# Altium schematic sheet 04. MCU + ANALOG.SchDoc
size A2
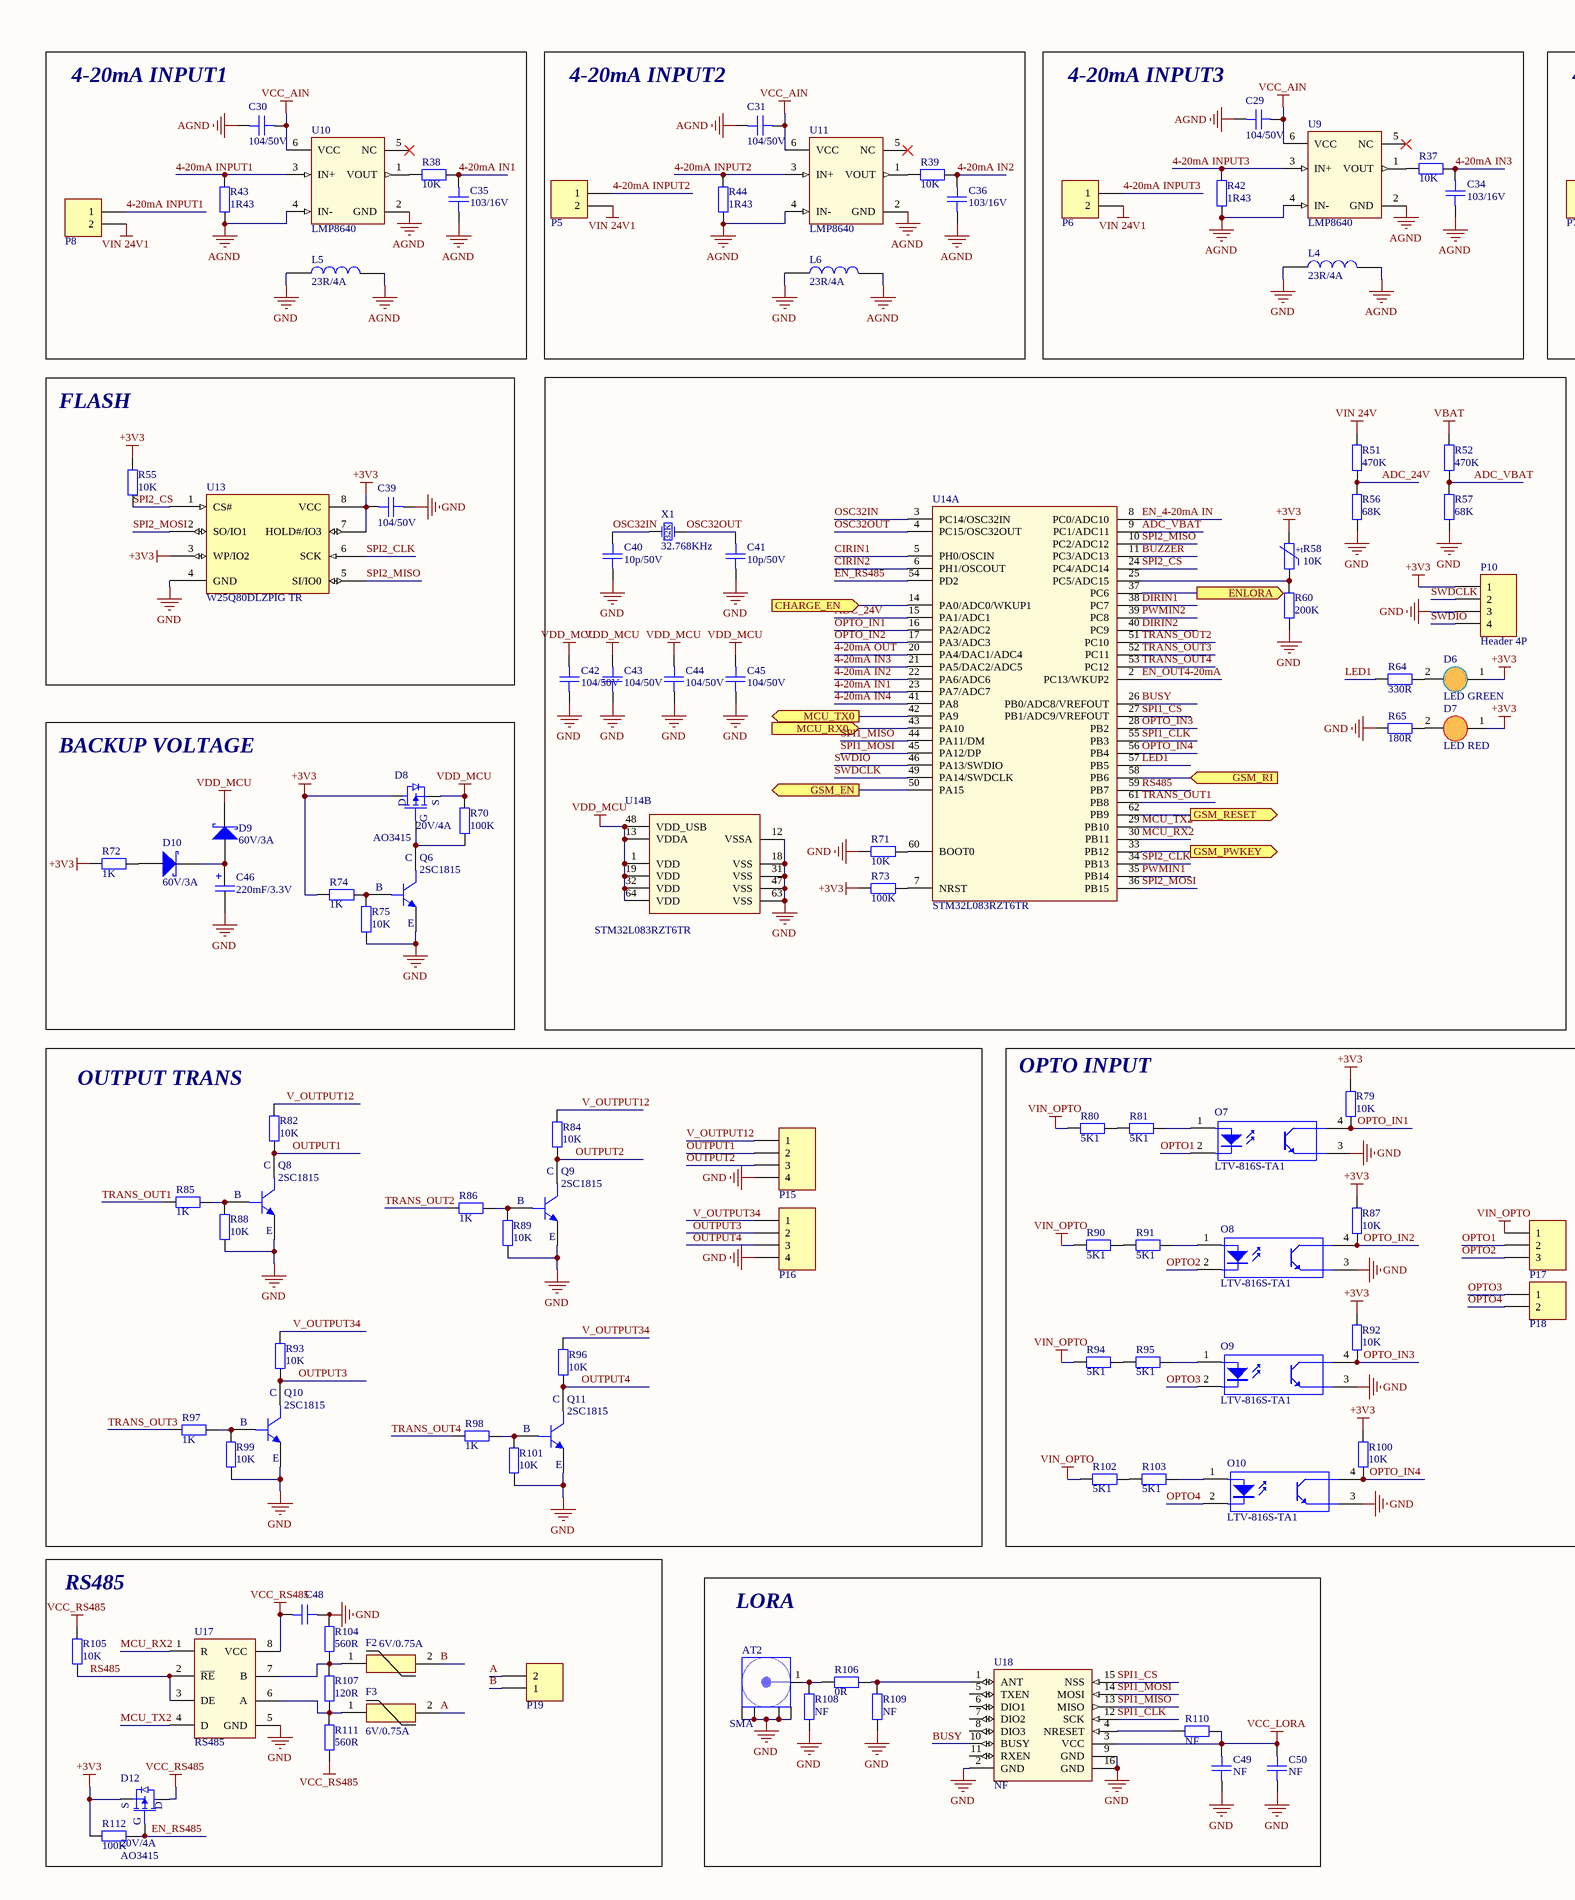
[diagram p0: 04. MCU + ANALOG.SchDoc, left]
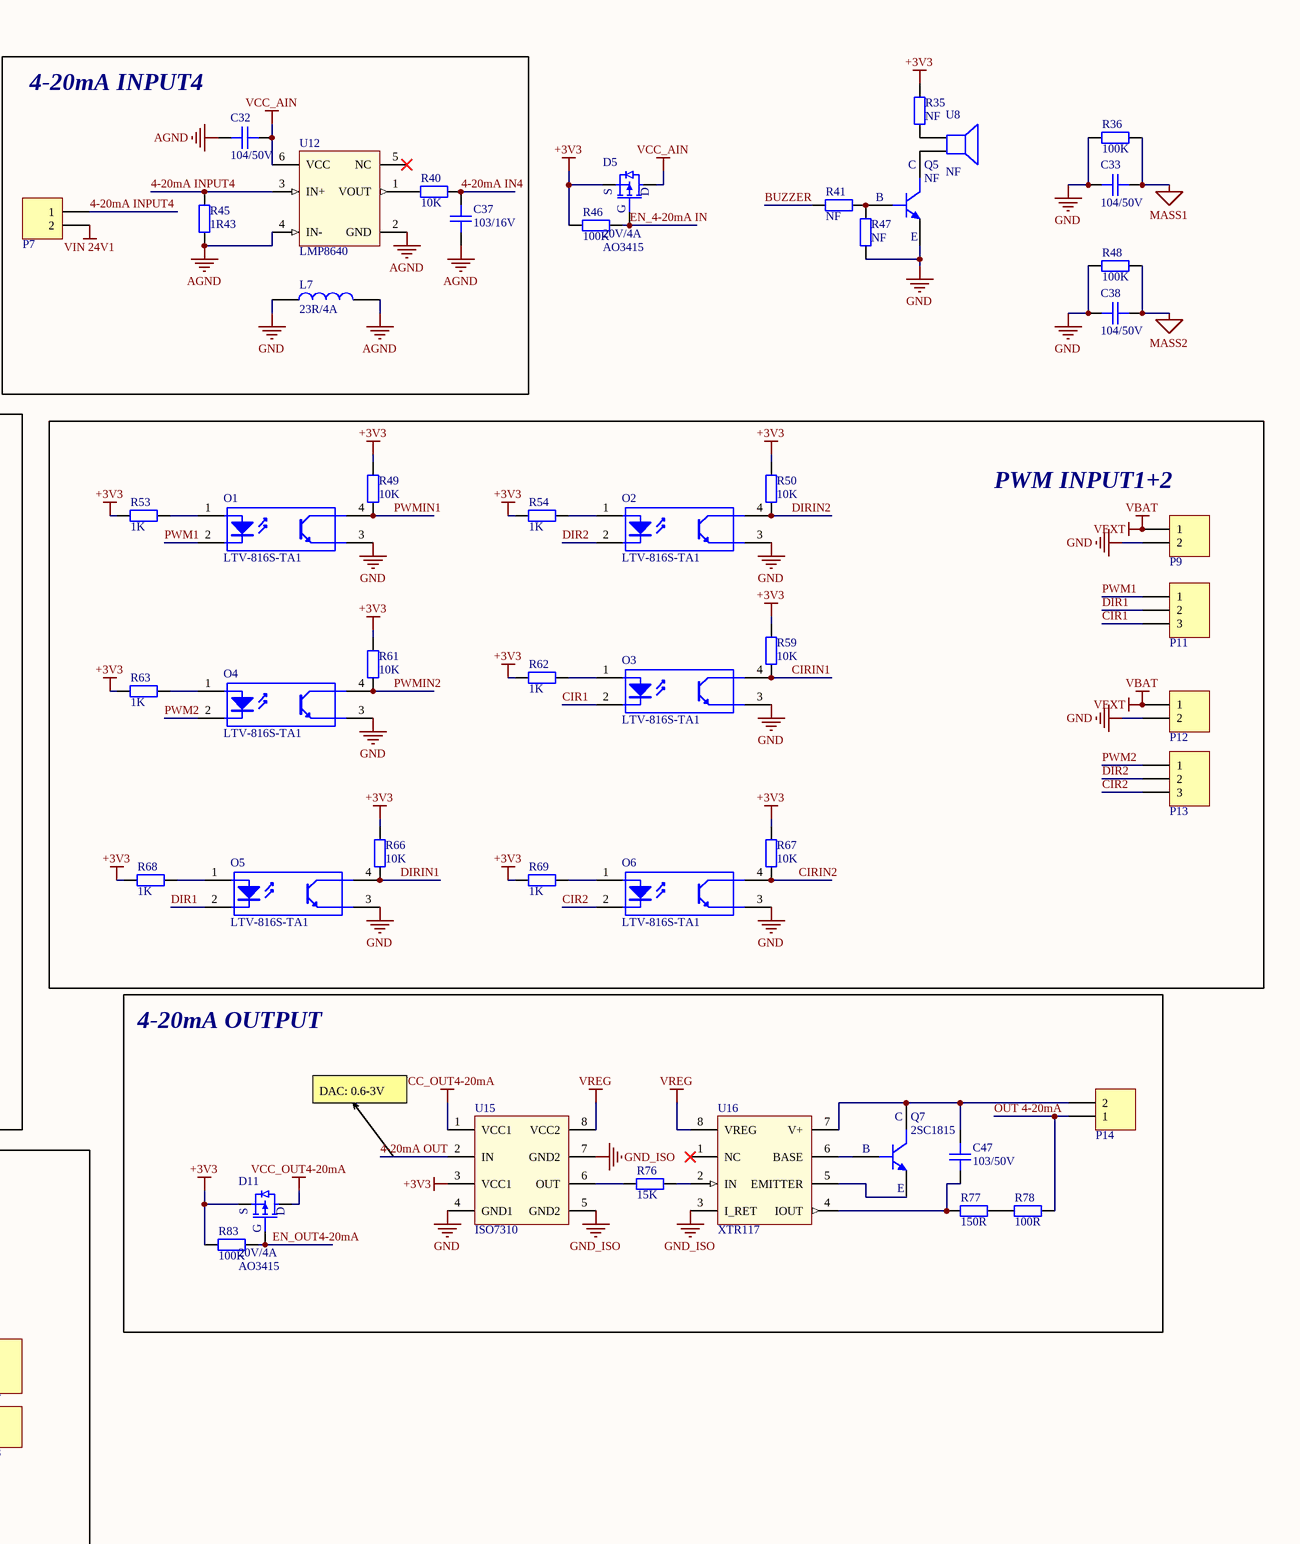
[diagram p1: 04. MCU + ANALOG.SchDoc, right]

## Parts
AT2  SMA  [SMA-KWE-17-V1]
C29  104/50V  [CAPC-0603 (1608)]
C30  104/50V  [CAPC-0603 (1608)]
C31  104/50V  [CAPC-0603 (1608)]
C32  104/50V  [CAPC-0603 (1608)]
C33  104/50V  [CAPC-0603 (1608)]
C34  103/16V  [CAPC-0603 (1608)]
C35  103/16V  [CAPC-0603 (1608)]
C36  103/16V  [CAPC-0603 (1608)]
C37  103/16V  [CAPC-0603 (1608)]
C38  104/50V  [CAPC-0603 (1608)]
C39  104/50V  [CAPC-0603 (1608)]
C40  10p/50V  [CAPC-0603 (1608)]
C41  10p/50V  [CAPC-0603 (1608)]
C42  104/50V  [CAPC-0603 (1608)]
C43  104/50V  [CAPC-0603 (1608)]
C44  104/50V  [CAPC-0603 (1608)]
C45  104/50V  [CAPC-0603 (1608)]
C46  220mF/3.3V  [CAP-SUPER-0.22F]
C47  103/50V  [CAPC-0805 (2012)]
C48  104/50V  [CAPC-0603 (1608)]  (value not drawn)
C49  NF  [CAPC-0603 (1608)]
C50  NF  [CAPC-0603 (1608)]
D5  20V/4A  [SOT23_3]
D6  LED GREEN  [LED_3MM-GREEN]
D7  LED RED  [LED_3MM-RED]
D8  20V/4A  [SOT23_3]
D9  60V/3A  [DIODE_DO214AC_SMA]
D10  60V/3A  [DIODE_DO214AC_SMA]
D11  20V/4A  [SOT23_3]
D12  20V/4A  [SOT23_3]
F2  6V/0.75A  [FUSE 0ZCK_BEL]
F3  6V/0.75A  [FUSE 0ZCK_BEL]
L4  23R/4A  [IND-0603 (1608)]
L5  23R/4A  [IND-0603 (1608)]
L6  23R/4A  [IND-0603 (1608)]
L7  23R/4A  [IND-0603 (1608)]
O1  LTV-816S-TA1  [OPTO 1]
O2  LTV-816S-TA1  [OPTO 1]
O3  LTV-816S-TA1  [OPTO 1]
O4  LTV-816S-TA1  [OPTO 1]
O5  LTV-816S-TA1  [OPTO 1]
O6  LTV-816S-TA1  [OPTO 1]
O7  LTV-816S-TA1  [OPTO 1]
O8  LTV-816S-TA1  [OPTO 1]
O9  LTV-816S-TA1  [OPTO 1]
O10  LTV-816S-TA1  [OPTO 1]
P5  15EDG3.81-2P  [HDR_3.81MM_RA_2x1]  (value not drawn)
P6  15EDG3.81-2P  [HDR_3.81MM_RA_2x1]  (value not drawn)
P7  15EDG3.81-2P  [HDR_3.81MM_RA_2x1]  (value not drawn)
P8  15EDG3.81-2P  [HDR_3.81MM_RA_2x1]  (value not drawn)
P9  15EDG3.81-2P  [HDR_3.81MM_RA_2x1]  (value not drawn)
P10  Header 4P  [HDR1X4]
P11  15EDG3.81-3P  [HDR_3.81MM_RA_3x1]  (value not drawn)
P12  15EDG3.81-2P  [HDR_3.81MM_RA_2x1]  (value not drawn)
P13  15EDG3.81-3P  [HDR_3.81MM_RA_3x1]  (value not drawn)
P14  15EDG3.81-2P  [HDR_3.81MM_RA_2x1]  (value not drawn)
P15  15EDG3.81-4P  [HDR_3.81MM_RA_4X1]  (value not drawn)
P16  15EDG3.81-4P  [HDR_3.81MM_RA_4X1]  (value not drawn)
P17  15EDG3.81-3P  [HDR_3.81MM_RA_3x1]  (value not drawn)
P18  15EDG3.81-2P  [HDR_3.81MM_RA_2x1]  (value not drawn)
P19  15EDG3.81-2P  [HDR_3.81MM_RA_2x1]  (value not drawn)
Q5  NF  [SOT23_3]
Q6  2SC1815  [SOT23_3]
Q7  2SC1815  [SOT23_3]
Q8  2SC1815  [SOT23_3]
Q9  2SC1815  [SOT23_3]
Q10  2SC1815  [SOT23_3]
Q11  2SC1815  [SOT23_3]
R35  NF  [RESC-0603 (1608)]
R36  100K  [RESC-0603 (1608)]
R37  10K  [RESC-0603 (1608)]
R38  10K  [RESC-0603 (1608)]
R39  10K  [RESC-0603 (1608)]
R40  10K  [RESC-0603 (1608)]
R41  NF  [RESC-0603 (1608)]
R42  1R43  [RESC-0603 (1608)]
R43  1R43  [RESC-0603 (1608)]
R44  1R43  [RESC-0603 (1608)]
R45  1R43  [RESC-0603 (1608)]
R46  100K  [RESC-0603 (1608)]
R47  NF  [RESC-0603 (1608)]
R48  100K  [RESC-0603 (1608)]
R49  10K  [RESC-0603 (1608)]
R50  10K  [RESC-0603 (1608)]
R51  470K  [RESC-0603 (1608)]
R52  470K  [RESC-0603 (1608)]
R53  1K  [RESC-0603 (1608)]
R54  1K  [RESC-0603 (1608)]
R55  10K  [RESC-0603 (1608)]
R56  68K  [RESC-0603 (1608)]
R57  68K  [RESC-0603 (1608)]
R58  10K  [RES NTC 10K]
R59  10K  [RESC-0603 (1608)]
R60  200K  [RESC-0603 (1608)]
R61  10K  [RESC-0603 (1608)]
R62  1K  [RESC-0603 (1608)]
R63  1K  [RESC-0603 (1608)]
R64  330R  [RESC-0603 (1608)]
R65  180R  [RESC-0603 (1608)]
R66  10K  [RESC-0603 (1608)]
R67  10K  [RESC-0603 (1608)]
R68  1K  [RESC-0603 (1608)]
R69  1K  [RESC-0603 (1608)]
R70  100K  [RESC-0603 (1608)]
R71  10K  [RESC-0603 (1608)]
R72  1K  [RESC-0603 (1608)]
R73  100K  [RESC-0603 (1608)]
R74  1K  [RESC-0603 (1608)]
R75  10K  [RESC-0603 (1608)]
R76  15K  [RESC-0603 (1608)]
R77  150R  [RESC-0603 (1608)]
R78  100R  [RESC-0603 (1608)]
R79  10K  [RESC-0603 (1608)]
R80  5K1  [RESC-0603 (1608)]
R81  5K1  [RESC-0603 (1608)]
R82  10K  [RESC-0603 (1608)]
R83  100K  [RESC-0603 (1608)]
R84  10K  [RESC-0603 (1608)]
R85  1K  [RESC-0603 (1608)]
R86  1K  [RESC-0603 (1608)]
R87  10K  [RESC-0603 (1608)]
R88  10K  [RESC-0603 (1608)]
R89  10K  [RESC-0603 (1608)]
R90  5K1  [RESC-0603 (1608)]
R91  5K1  [RESC-0603 (1608)]
R92  10K  [RESC-0603 (1608)]
R93  10K  [RESC-0603 (1608)]
R94  5K1  [RESC-0603 (1608)]
R95  5K1  [RESC-0603 (1608)]
R96  10K  [RESC-0603 (1608)]
R97  1K  [RESC-0603 (1608)]
R98  1K  [RESC-0603 (1608)]
R99  10K  [RESC-0603 (1608)]
R100  10K  [RESC-0603 (1608)]
R101  10K  [RESC-0603 (1608)]
R102  5K1  [RESC-0603 (1608)]
R103  5K1  [RESC-0603 (1608)]
R104  560R  [RESC-0603 (1608)]
R105  10K  [RESC-0603 (1608)]
R106  0R  [RESC-0603 (1608)]
R107  120R  [RESC-0603 (1608)]
R108  NF  [RESC-0603 (1608)]
R109  NF  [RESC-0603 (1608)]
R110  NF  [RESC-0603 (1608)]
R111  560R  [RESC-0603 (1608)]
R112  100K  [RESC-0603 (1608)]
U8  NF  [BUZZER_through_hole]
U9  LMP8640  [SOT23-6]
U10  LMP8640  [SOT23-6]
U11  LMP8640  [SOT23-6]
U12  LMP8640  [SOT23-6]
U13  W25Q80DLZPIG TR  [WSON-8 6X5MM]
U14  STM32L083RZT6TR  [LQFP-64]  (parts A,B of 2)
U15  ISO7310  [SOIC-8]
U16  XTR117  [8VSSOP]
U17  RS485  [SOIC8]
U18  NF  [Lora1276 V1.2]
X1  32.768KHz  [CRYSTAL_ABS06 2x1.2mm]

## Blocks framed on the sheet
4-20mA INPUT1: C30 C35 L5 P8 R38 R43 U10
4-20mA INPUT2: C31 C36 L6 P5 R39 R44 U11
4-20mA INPUT3: C29 C34 L4 P6 R37 R42 U9
4-20mA INPUT4: C32 C37 L7 P7 R40 R45 U12
FLASH: C39 R55 U13
PWM INPUT1+2: O1-O6 P9 P11-P13 R49 R50 R53 R54 R59 R61-R63 R66-R69
BACKUP VOLTAGE: C46 D8-D10 Q6 R70 R72 R74 R75
4-20mA OUTPUT: C47 D11 P14 Q7 R76-R78 R83 U15 U16
OUTPUT TRANS: P15 P16 Q8-Q11 R82 R84-R86 R88 R89 R93 R96-R99 R101
OPTO INPUT: O7-O10 P17 P18 R79-R81 R87 R90-R92 R94 R95 R100 R102 R103
RS485: C48 D12 F2 F3 P19 R104 R105 R107 R111 R112 U17
LORA: AT2 C49 C50 R106 R108-R110 U18

## Ports
CHARGE_EN (in), ENLORA (out), GSM_EN (out), GSM_PWKEY (out), GSM_RESET (out), GSM_RI (in), MCU_RX0 (in), MCU_TX0 (out)

## Nets
+3V3: C39.2 D5.2(S) D6.1(A) D7.1(A) D8.3(D) D11.2(S) D12.2(S) P10.1 R35.2 R46.2 R49.1 R50.1 R53.1 R54.1 R55.1 R58.2 R59.1 R61.1 R62.1 R63.1 R66.1 R67.1 R68.1 R69.1 R72.2 R73.1 R74.1 R79.2 R83.2 R87.2 R92.2 R100.2 R112.2 U13.3(WP/IO2) U13.7(HOLD#/IO3) U13.8(VCC) U15.3(VCC1)
AGND: C29.2 C30.2 C31.2 C32.2 C34.1 C35.1 C36.1 C37.1 L4.2 L5.2 L6.2 L7.2 R42.1 R43.1 R44.1 R45.1 U9.2(GND) U9.4(IN-) U10.2(GND) U10.4(IN-) U11.2(GND) U11.4(IN-) U12.2(GND) U12.4(IN-)
GND: AT2.2 C33.1 C38.1 C39.1 C40.1 C41.1 C42.1 C43.1 C44.1 C45.1 C46.2 C48.1 C49.1 C50.1 L4.1 L5.1 L6.1 L7.1 O1.3 O2.3 O3.3 O4.3 O5.3 O6.3 O7.3 O8.3 O9.3 O10.3 P9.2 P10.3 P12.2 P15.4 P16.4 Q5.2(E) Q6.2(E) Q8.2(E) Q9.2(E) Q10.2(E) Q11.2(E) R36.1 R47.1 R48.1 R56.1 R57.1 R60.1 R65.1 R71.2 R75.1 R88.1 R89.1 R99.1 R101.1 R104.2 R108.1 R109.1 U13.4(GND) U14.12(VSSA) U14.18(VSS) U14.31(VSS) U14.47(VSS) U14.63(VSS) U15.4(GND1) U17.5(GND) U18.2(GND) U18.9(GND) U18.16(GND)
GND_ISO: U15.5(GND2) U15.7(GND2) U16.3(I_RET)
MASS1: C33.2 R36.2
MASS2: C38.2 R48.2
VBAT: P9.1 P12.1 R52.2  [also labelled VEXT]
VCC_AIN: C29.1 C30.1 C31.1 C32.1 D5.3(D) U9.6(VCC) U10.6(VCC) U11.6(VCC) U12.6(VCC)
VCC_LORA: C49.2 C50.2 R110.2 U18.3(VCC)
VCC_OUT4-20mA: D11.3(D) U15.1(VCC1)
VCC_RS485: C48.2 D12.3(D) R105.2 R111.1 U17.8(VCC)
VDD_MCU: C42.2 C43.2 C44.2 C45.2 D8.2(S) D9.2(K) R70.2 U14.1(VDD) U14.13(VDDA) U14.19(VDD) U14.32(VDD) U14.48(VDD_USB) U14.64(VDD)
VIN 24V: R51.2
VIN 24V1: P5.2 P6.2 P7.2 P8.2
VIN_OPTO: P17.1 R80.1 R90.1 R94.1 R102.1
VREG: U15.8(VCC2) U16.8(VREG)
4-20mA IN1: C35.2 R38.1 U14.23(PA7/ADC7)
4-20mA IN2: C36.2 R39.1 U14.22(PA6/ADC6)
4-20mA IN3: C34.2 R37.1 U14.21(PA5/DAC2/ADC5)
4-20mA IN4: C37.2 R40.1 U14.41(PA8)
4-20mA INPUT1: P8.1 R43.2 U10.3(IN+)
4-20mA INPUT2: P5.1 R44.2 U11.3(IN+)
4-20mA INPUT3: P6.1 R42.2 U9.3(IN+)
4-20mA INPUT4: P7.1 R45.2 U12.3(IN+)
4-20mA OUT: U14.20(PA4/DAC1/ADC4) U15.2(IN)
A: F3.2 P19.2
ADC_24V: R51.1 R56.2 U14.15(PA1/ADC1)
ADC_VBAT: R52.1 R57.2 U14.9(PC1/ADC11)
B: F2.2 P19.1
BUSY: U14.26(PB0/ADC8/VREFOUT) U18.10(BUSY)
BUZZER: R41.1 U14.11(PC3/ADC13)
CHARGE_EN: U14.14(PA0/ADC0/WKUP1) ; port CHARGE_EN
CIR1: O3.2 P11.3
CIR2: O6.2 P13.3
CIRIN1: O3.4 R59.2 U14.5(PH0/OSCIN)
CIRIN2: O6.4 R67.2 U14.6(PH1/OSCOUT)
DIR1: O5.2 P11.2
DIR2: O2.2 P13.2
DIRIN1: O5.4 R66.2 U14.38(PC7)
DIRIN2: O2.4 R50.2 U14.40(PC9)
EN_4-20mA IN: D5.1(G) R46.1 U14.8(PC0/ADC10)
EN_OUT4-20mA: D11.1(G) R83.1 U14.2(PC13/WKUP2)
EN_RS485: D12.1(G) R112.1 U14.54(PD2)
ENLORA: U14.37(PC6) ; port ENLORA
GSM_EN: U14.50(PA15) ; port GSM_EN
GSM_PWKEY: U14.33(PB12) ; port GSM_PWKEY
GSM_RESET: U14.62(PB9) ; port GSM_RESET
GSM_RI: U14.58(PB6) ; port GSM_RI
LED1: R64.1 U14.57(PB5)
MCU_RX0: U14.43(PA10) ; port MCU_RX0
MCU_RX2: U14.30(PB11) U17.1(R)
MCU_TX0: U14.42(PA9) ; port MCU_TX0
MCU_TX2: U14.29(PB10) U17.4(D)
OPTO1: O7.2 P17.2
OPTO2: O8.2 P17.3
OPTO3: O9.2 P18.1
OPTO4: O10.2 P18.2
OPTO_IN1: O7.4 R79.1 U14.16(PA2/ADC2)
OPTO_IN2: O8.4 R87.1 U14.17(PA3/ADC3)
OPTO_IN3: O9.4 R92.1 U14.28(PB2)
OPTO_IN4: O10.4 R100.1 U14.56(PB4)
OSC32IN: C40.2 U14.3(PC14/OSC32IN) X1.1(OSC1)
OSC32OUT: C41.2 U14.4(PC15/OSC32OUT) X1.2(OSC2)
OUT 4-20mA: P14.1 R78.2
OUTPUT1: P15.2 Q8.3(C) R82.1
OUTPUT2: P15.3 Q9.3(C) R84.1
OUTPUT3: P16.2 Q10.3(C) R93.1
OUTPUT4: P16.3 Q11.3(C) R96.1
PWM1: O1.2 P11.1
PWM2: O4.2 P13.1
PWMIN1: O1.4 R49.2 U14.35(PB14)
PWMIN2: O4.4 R61.2 U14.39(PC8)
RS485: R105.1 U14.59(PB7) U17.2(~{RE}) U17.3(DE)
SPI1_CLK: U14.55(PB3) U18.12(SCK)
SPI1_CS: U14.27(PB1/ADC9/VREFOUT) U18.15(NSS)
SPI1_MISO: U14.44(PA11/DM) U18.13(MISO)
SPI1_MOSI: U14.45(PA12/DP) U18.14(MOSI)
SPI2_CLK: U13.6(SCK) U14.34(PB13)
SPI2_CS: R55.2 U13.1(CS#) U14.24(PC4/ADC14)
SPI2_MISO: U13.5(SI/IO0) U14.10(PC2/ADC12)
SPI2_MOSI: U13.2(SO/IO1) U14.36(PB15)
SWDCLK: P10.2 U14.49(PA14/SWDCLK)
SWDIO: P10.4 U14.46(PA13/SWDIO)
TRANS_OUT1: R85.1 U14.61(PB8)
TRANS_OUT2: R86.1 U14.51(PC10)
TRANS_OUT3: R97.1 U14.52(PC11)
TRANS_OUT4: R98.1 U14.53(PC12)
V_OUTPUT12: P15.1 R82.2 R84.2
V_OUTPUT34: P16.1 R93.2 R96.2
NetAT2_1: AT2.1(Signal) R106.2 R108.2
NetC46_1: C46.1 D9.1(A) D10.2(K)
NetC47_1: C47.1 R77.1 U16.4(IOUT)
NetC47_2: C47.2 P14.2 Q7.3(C) U16.7(V+)
NetD6_2: D6.2(K) R64.2
NetD7_2: D7.2(K) R65.2
NetD8_1: D8.1(G) Q6.3(C) R70.1
NetD10_1: D10.1(A) R72.1
NetF2_1: F2.1 R104.1 R107.2 U17.7(B)
NetF3_1: F3.1 R107.1 R111.2 U17.6(A)
NetO1_1: O1.1 R53.2
NetO2_1: O2.1 R54.2
NetO3_1: O3.1 R62.2
NetO4_1: O4.1 R63.2
NetO5_1: O5.1 R68.2
NetO6_1: O6.1 R69.2
NetO7_1: O7.1 R81.2
NetO8_1: O8.1 R91.2
NetO9_1: O9.1 R95.2
NetO10_1: O10.1 R103.2
NetQ5_1: Q5.1(B) R41.2 R47.2
NetQ5_3: Q5.3(C) U8.2
NetQ6_1: Q6.1(B) R74.2 R75.2
NetQ7_1: Q7.1(B) U16.6(BASE)
NetQ7_2: Q7.2(E) U16.5(EMITTER)
NetQ8_1: Q8.1(B) R85.2 R88.2
NetQ9_1: Q9.1(B) R86.2 R89.2
NetQ10_1: Q10.1(B) R97.2 R99.2
NetQ11_1: Q11.1(B) R98.2 R101.2
NetR35_1: R35.1 U8.1
NetR37_2: R37.2 U9.1(VOUT)
NetR38_2: R38.2 U10.1(VOUT)
NetR39_2: R39.2 U11.1(VOUT)
NetR40_2: R40.2 U12.1(VOUT)
NetR58_1: R58.1 R60.2 U14.25(PC5/ADC15)
NetR71_1: R71.1 U14.60(BOOT0)
NetR73_2: R73.2 U14.7(NRST)
NetR76_1: R76.1 U15.6(OUT)
NetR76_2: R76.2 U16.2(IN)
NetR77_2: R77.2 R78.1
NetR80_2: R80.2 R81.1
NetR90_2: R90.2 R91.1
NetR94_2: R94.2 R95.1
NetR102_2: R102.2 R103.1
NetR106_1: R106.1 R109.2 U18.1(ANT)
NetR110_1: R110.1 U18.4(NRESET)

Not connected (* = marked no-connect by the designer): U9 5(NC)*; U10 5(NC)*; U11 5(NC)*; U12 5(NC)*; U16 1(NC)*; U18 5(TXEN) 6(DIO1) 7(DIO2) 8(DIO3) 11(RXEN)

## Notes on the sheet
- DAC: 0.6-3V
- File:
- Project:
- REV:
- Sheet:
- Drawn By:
- Size:
- A2
- DRAFT
- Checked By:
- Approved By:
- (in symbol 01M1002JF) +t
- (in symbol ABS06-107-32.768kHz-T) 32K

## Library data of the parts
AT2 = GKZS-SMAJZM-KWE-17.3: MFR: GAOKE; Solder: WAVE; MPN: GKZS-SMAJZM-KWE-17.3; Value: SMA
C29-C33 C38 C39 C42-C45 C48 = C0603C104K5RACTU: CAP CER 0.1uF 50V 10% X7R 0603; Solder: SMT; Company ID: VT00574; MPN: C0603C104K5RACTU; Value: 104/50V
C34-C37 = CC0603KRX7R7BB103: CAP CER 10nF 16V 10% X7R 0603; Solder: SMT; Company ID: VT00031; MPN: CC0603KRX7R7BB103; Value: 103/16V
C40 C41 = CL10C100JB8NNND: CAP CER 10pF 5% 50V NP0 0603; Solder: SMT; Company ID: VT00076; Value: 10p/50V; MPN: CL10C100JB8NNND
C46 = DCK-3R3E224U-E: CAP 220mF SUPER -20% +80% 3.3V SMD; Solder: HAND; Company ID: VT00087; MPN: DCK-3R3E224U-E; value: 220mF/3.3V
C47 = CL21B103KBANNNC: CAP CER 10nF 10% 50V X7R 0805; Solder: SMT; Value: 103/50V; MPN: CL21B103KBANNNC
C49 = C0603C104K5RACTU: CAP CER 0.1uF 50V 10% X7R 0603; Solder: SMT; Value: 104/50V; Company ID: VT00574; MPN: C0603C104K5RACTU
C50 = CL10A106KP8NNNC: CAP CER 10uF 10% 10V X5R 0603; Solder: SMT; Value: 106/10V; MPN: CL10A106KP8NNNC
D5 D8 D11 D12 = AO3415: MOSFET P-CH 20V 4A SOT23; MFR: Alpha & Omega Semiconductor Inc.; Company ID: VT00490; CATEGORY: DIODE; SOLDER: SOT23; VALUE: 20V/4A; MPN: AO3415
D6 = OVLBG4C7: LED GREEN CLEAR 3MM ROUND T/H; Solder: WAVE; MPN: OVLBG4C7; Value: LED GREEN
D7 = WP710A10SRC/E: LED RED CLEAR 3MM ROUND T/H; Solder: WAVE; MPN: WP710A10SRC/E; Value: LED RED
D9 D10 = SK36A-LTP: DIODE SCHOTTKY 60V 3A DO214AC; MPN: SK36A-LTP; Category: Diode; Solder: DO214AC; Value: 60V/3A
F2 F3 = 0ZCK0075FF2E: PTC RESET FUSE 6V 750MA 0805; Manufacturer: Bel Fuse Inc.; Solder: SMT; MPN: 0ZCK0075FF2E; Category: Fuse; Value: 6V/0.75A
L4-L7 = FBMJ1608HM230NT: IND-FERRITE BEAD 23 OHM  4A 0603 1LN; Solder: SMT; Company ID: VT00326; MPN: FBMJ1608HM230NT; Value: 23R/4A
O1-O10 = LTV-816S-TA1: OPTOISOLATR 5KV TRANSISTOR 4-SMD; MFR: Lite-On Inc.; Solder: SMD 4P; MPN: LTV-816S-TA1; Value: LTV-816S-TA1; Category: Opto
P5-P9 P12 P14 P18 P19 = 15EDG3.81-2P: Pluggable terminal 15EDG- 2P 3.81MM; MFR: China; Solder: Hand; MPN: 15EDG3.81-2P; Value: 15EDG3.81-2P; Company ID: *; MPN2: CLA5048
P10 = Header 4x1: Header, 4 Pin Pitch 2.54mm; MPN: S1012EC-40-ND; Company ID: VT-00125; Solder: WAVE; Value: Header 4P
P11 P13 P17 = 15EDG3.81-3P: Pluggable terminal 15EDG- 3P 3.81MM; MFR: China; Solder: Hand; MPN: 15EDG3.81-3P; Value: 15EDG3.81-3P; Company ID: *; MPN2: CLA5050
P15 P16 = 15EDG3.81-4P: Pluggable terminal 15EDG- 4P 3.81MM; MFR: China; Solder: Hand; MPN: 15EDG3.81-4P; Value: 15EDG3.81-4P; Company ID: *; MPN2: CLA5052
Q5-Q11 = 2SC1815: TRANS NPN 50V 0.15A SOT23-3; Solder: SMT; Company ID: VT00492; MPN: 2SC1815; Value: 2SC1815; Category: Transistor
R35 = RC0603FR-0710RL: RES SMD 10 OHM 1% 1/10W 0603; Solder: SMT; Value: 10R; MPN: RC0603FR-0710RL
R36 R46 R48 R70 R73 R83 R112 = RC0603FR-07100KL: RES SMD 100K OHM 1% 1/10W 0603; Solder: SMT; Company ID: VT00424; MPN: RC0603FR-07100KL; Value: 100K
R37-R40 R47 R49 R50 R55 R59 R61 R66 R67 R71 R75 R79 R82 R84 R87-R89 R92 R93 R96 R99-R101 R105 R110 = RC0603FR-0710KL: RES SMD 10K OHM 1% 1/10W 0603; Solder: SMT; Company ID: VT00426; MPN: RC0603FR-0710KL; Value: 10K
R41 = RC0603FR-071KL: RES SMD 1 KOHM 1% 1/10W 0603; Solder: SMT; Value: 1K; Company ID: VT00433; MPN: RC0603FR-071KL
R42-R45 = RT0603BRE071R43L: RES SMD 1.43 OHM 0.1% 1/10W 0603; MFR: YAGEO; MPN: RT0603BRE071R43L; CATEGORY: RESISTOR; SOLDE: RES-0603; Value: 1R43; COMPANY ID: *
R51 R52 = RC0603FR-07470KL: RES SMD 470K OHM 1% 1/10W 0603; Solder: SMT; Company ID: VT00448; Value: 470K; MPN: RC0603FR-07470K
R53 R54 R62 R63 R68 R69 R72 R74 R85 R86 R97 R98 = RC0603FR-071KL: RES SMD 1 KOHM 1% 1/10W 0603; Solder: SMT; Company ID: VT00433; MPN: RC0603FR-071KL; Value: 1K
R56 R57 = CRCW060368K0FKEA: RES SMD 68K OHM 1% 1/10W 0603; Solder: SMT; MPN: CRCW060368K0FKEA; Value: 68K
R58 = 01M1002JF: THERMISTOR NTC 10KOHM 3964K BEAD; MFR: Vishay; Solder: Wave; MPN: 01M1002JF; Value: 10K; Category: RESISTOR
R60 = CR0603-FX-2003ELF: RES SMD 200K OHM 1% 1/10W 0603; MPN: CR0603-FX-2003ELF; VALUE: 200K; Category: Resistor
R64 = RC0603FR-07330RL: RES SMD 330 OHM 1% 1/10W 0603; Solder: SMT; Company ID: VT00443; Value: 330R; MPN: RC0603FR-07330RL
R65 = RC0603FR-07180RL: RES SMD 180 OHM 1% 1/10W 0603; Solder: SMT; Company ID: VT00430; Value: 180R; MPN: RC0603FR-07180RL
R76 = RT0603BRE-0715KL: RES SMD 15K OHM 0.1% 1/10W 0603; Value: 15K; MPN: RT0603BRE-0715KL; CATEGORY: RESISTOR; SOLDER: RES-0603; COMPANY ID: *
R77 = RC0603FR-07150RP: RES SMD 150 OHM 1% 1/10W 0603; MFR: YAGEO; MPN: RC0603FR-07150RP; CATEGORY: RESISTOR; SOLDER: RES-0603; Value: 150R; COMPANY ID: *
R78 = RC0603FR-07100RL: RES SMD 100 OHM 1% 1/10W 0603; Solder: SMT; Company ID: VT00425; MPN: RC0603FR-07100RL; Value: 100R
R80 R81 R90 R91 R94 R95 R102 R103 = RC0603FR-075K1L: RES SMD 5.1K OHM 1% 1/10W 0603; MFR: Yageo; Company ID: VT00457; MPN: RC0603FR-075K1L; CATEGORY: RESISTOR; VALUE: 5K1
R104 R111 = RC0603FR-07560RL: RES SMD 560 OHM 1% 1/10W 0603; Solder: SMT; Company ID: VT00455; MPN: RC0603FR-07560RL; Value: 560R
R106 = RC0603FR-070RL: RES SMD 0.0OHM JUMPER 1/10W 0603; Solder: SMT; Company ID: VT00423; MPN: RC0603FR-070RL; Value: 0R
R107 = RC0603FR-07120RL: RES SMD 120 OHM 1% 1/10W 0603; Solder: SMT; Company ID: VT00427; MPN: RC0603FR-07120RL; Value: 120R
R108 R109 = RC0603FR-070RL: RES SMD 0.0OHM JUMPER 1/10W 0603; Value: 0R; Solder: SMT; Company ID: VT00423; MPN: RC0603FR-070RL
U8 = Speaker: Loudspeaker; BAPartNumber: VT-0; MPN: CLA2021; Solder: WAVE; Value: BUZZ; Published: 24-Mar-1999; LatestRevisionDate: 17-Jul-2002; LatestRevisionNote: Re-released for DXP Platform.; PackageReference: PIN2; Publisher: Altium Limited; Parameter 1: *
U9-U12 = LMP8640MK-H/NOPB: IC CURR SENSE 1 CIRCUIT TSOT23-6; MFR: TI; MPN: LMP8640MK-H/NOPB; CATEGORY: IC; SOLDER: SOT23-6; Value: LMP8640; COMPANY ID: *
U13 = W25Q80DLZPIG TR: IC FLSH 8MBIT SPI/QUAD I/O 8WSON; MFR: Winbond Electronics; Solder: SMT; MPN: W25Q80DLZPIG TR; Value: W25Q80DLZPIG TR; Category: IC; Company ID: *
U14 = STM32L083RZT6TR: IC MCU 32BIT 192KB FLASH 64LQFP; MFR: ST; MPN: STM32L083RZT6TR; CATEGORY: IC; SOLDER: 64 LQFP; Value: STM32L083RZT6TR; COMPANY ID: *
U15 = ISO7310CQDRQ1: DGTL ISO 3000VRMS 1CH 8SOIC; MFR: TI; MPN: ISO7310CQDRQ1; SOLDER: SOIC-8; CATEGORY: IC; Value: ISO7310; COMPANY ID: *
U16 = XTR117AIDGKR: IC CURRENT TRANSMITTER 8VSSOP; MFR: Texas Instruments; MPN: XTR117AIDGKR; CATEGORY: IC; SOLDER: 8VSSOP; Value: XTR117; Company ID: *
U17 = SN65HVD72DR: IC TRANSCEIVER HALF 1/1 8SOIC; MFR: TI; SOLDER: SOIC-8; MPN: SN65HVD72DR; CATEGORY: IC; VALUE: RS485
U18 = RA-01S: Module lora RA-01S SX1268; MFR: AI-THINKER; Solder: SMT 16; MPN: RA-01S; Category: Module; Value: RA-01S
X1 = ABS06-107-32.768kHz-T: CRYSTAL 32.7680KHZ 4pF SMD; Solder: SMT; Company ID: VT00159; Value: 32.768KHz; MPN: ABS06-107-32.768kHz-T